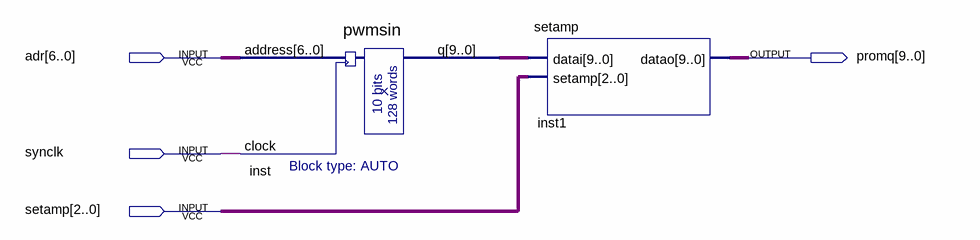
[diagram p0: schematic sheet]
// Quartus schematic pwmsint.bdf as structural Verilog: 2 symbols, 4 pins
module pwmsint (
  input  [6:0] adr,
  input  synclk,
  input  [2:0] setamp,
  output [9:0] promq
);

  wire [9:0] inst_q;

  pwmsin inst (.address(adr), .clock(synclk), .q(inst_q));
  setamp inst1 (.datai(inst_q), .setamp(setamp), .datao(promq));
endmodule
